# EAGLE design SmartRock_OsmoPod (EAGLE 9.5.1)
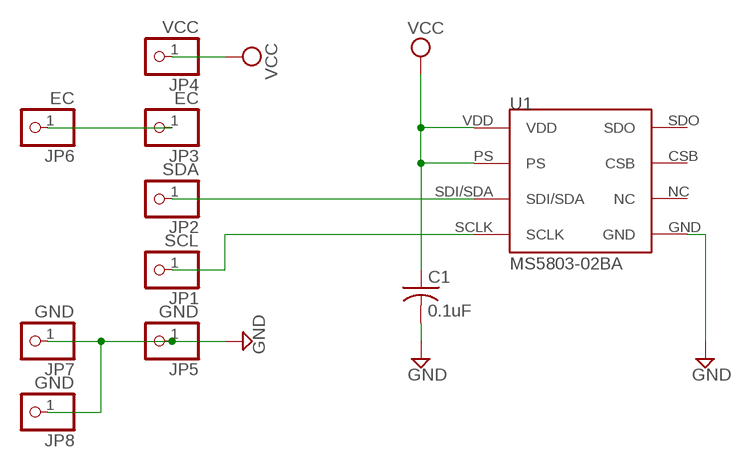
[diagram p0: schematic, sheet 1]

## Parts
C1  0.1uF  C-USC1206  [C1206]
JP1  SCL  PINHD-1X1  [1X01]
JP2  SDA  PINHD-1X1  [1X01]
JP3  EC  PINHD-1X1  [1X01]
JP4  VCC  PINHD-1X1  [1X01]
JP5  GND  PINHD-1X1  [1X01]
JP6  EC  PINHD-1X1  [1X01]
JP7  GND  PINHD-1X1  [1X01]
JP8  GND  PINHD-1X1  [1X01]
U1  MS5803-02BA  [MS5803-02BA]

## Nets
GND: C1.2 JP5.1 JP7.1 JP8.1 U1.GND
N$1: JP2.1 U1.SDI/SDA
N$2: JP1.1 U1.SCLK
N$3: JP3.1 JP6.1
VCC: C1.1 JP4.1 U1.PS U1.VDD
Unconnected: U1.CSB U1.NC U1.SDO

## Library data of the parts
C1 = adafruit:C-US: CAPACITOR, American symbol
JP1-JP8 = pinhead_simple:PINHD-1X1: PIN HEADER
U1 = PNNL_Probe:MS5803-02BA

## Board
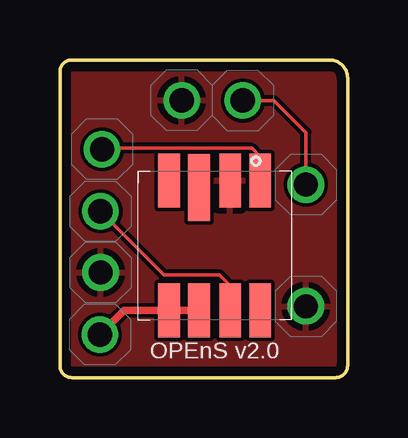
[diagram p1: board, top side]
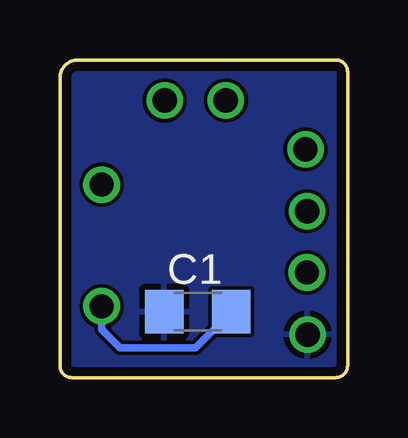
[diagram p2: board, bottom side, seen from below]

Size 12 x 13.25 mm. Coordinates in mm from the lower left corner, seen from the top.
Outline: 0.5,13.25 11.25,13.25 arc-90 12,12.5 12,0.5 arc-90 11.5,0 0.5,0 arc-90 0,0.5 0,12.75 arc-90 0.5,13.25
Copper layers (1*16): Top 0.035559375mm / dielectric 1.6mm / Bottom 0.035559375mm
Design rules "oshpark-2layer": minimum track width 6mil, minimum drill 10mil, track to track 6mil, track to pad 6mil, pad to pad 6mil, via to via 6mil, smd to smd 6mil, copper to edge 15mil, drill to drill 6mil, minimum pad ring 5mil, minimum via ring 5mil, stop-mask expansion 2.5mil, vias tented up to drill 0mil, thermal gap 10mil

### Footprints (pad centres in the part's own frame; a part is rotated, then mirrored left to right if it is on the bottom)
C1206 = smd 1.6 x 1.8: 1 -1.4,0; 2 1.4,0
1X01 = drill 1.016: 1 0,0
MS5803-02BA = smd 2.8 x 0.9: CSB 2.42,0.65 | smd 2.25 x 0.9: GND 2.7,-0.65; NC 2.7,1.9; PS -2.7,0.65; SCLK 2.7,-1.9; SDI/SDA -2.7,-0.65; SDO -2.7,-1.9; VDD -2.7,1.9

### Placement (x,y rotation side)
C1  6.25,2.75 0 bottom
JP1  1.76,9.52 0 top
JP2  1.69,6.94 0 top
JP3  10.26,8.05 0 top
JP4  1.67,1.79 0 top
JP5  10.26,2.97 0 top
JP6  7.63,11.56 0 top
JP7  5.08,11.56 0 top
JP8  1.7,4.38 0 top
U1  6.45,5.51 90 top

### Tracks (layer width: path | path; a pad name or v marks a point on that pad's centre or on a via)
GND
  Bottom 0.305: C1.2 6.35,1.25 9.5,1.25 10.26,2.01 JP5.1
  pour Top: -0.5,13.25 -0.5,0 0.25,-0.75 11.5,-0.75 11.75,-0.75 12.5,0 12.5,0.25 12.5,13.25 12,13.75 0,13.75
N$1
  Top 0.152: U1.SDI/SDA 7.1,3.84 6.65,4.29 4.34,4.29 JP2.1
N$2
  Top 0.152: U1.SCLK 8.35,9.22 8.01,9.56 1.8,9.56 JP1.1
N$3
  Top 0.152: JP3.1 10.26,10.22 8.92,11.56 JP6.1
VCC
  Top 0.305: U1.PS U1.VDD 2.68,2.81 JP4.1
  pour Bottom: -0.5,13.25 -0.5,0 0.25,-0.75 11.75,-0.75 12.5,0 12.5,13.25 12.5,13.75 -0.5,13.75

### Text on the board
tPlace: OPEnS v2.0